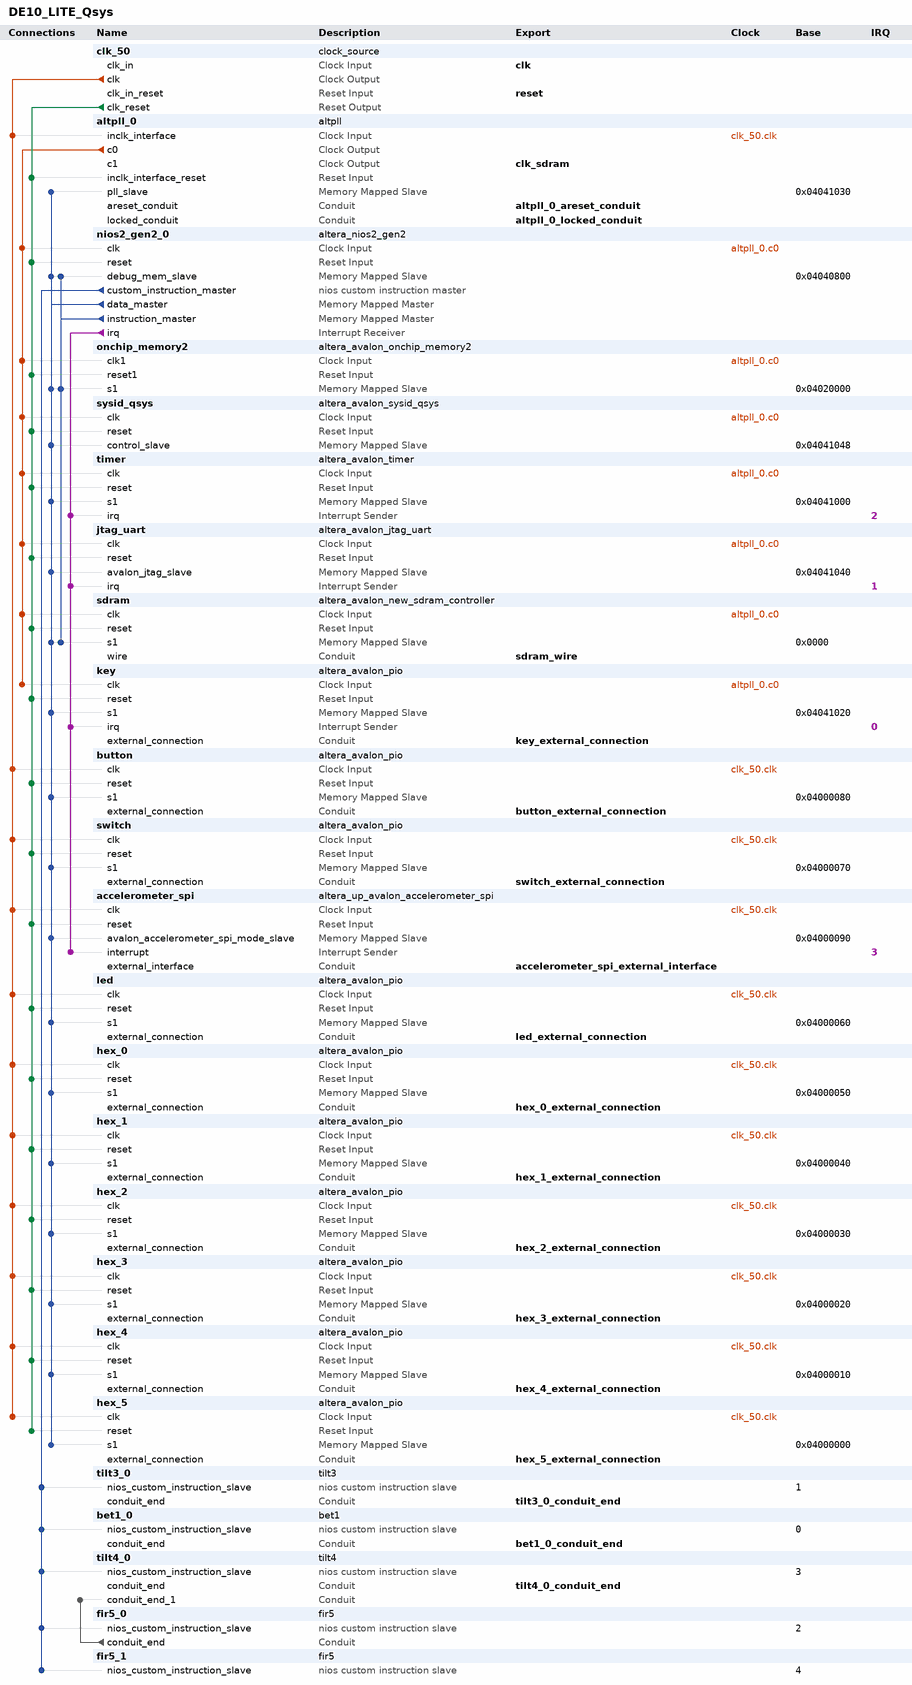
[diagram p0: system contents]
# Platform Designer (Qsys) system DE10_LITE_Qsys, MAX 10 10M50DAF484C7G
# Parameters at their usual value, and those the tool derives, are not listed.
package require -exact qsys 20.1
create_system DE10_LITE_Qsys
set_project_property DEVICE_FAMILY {MAX 10}
set_project_property DEVICE 10M50DAF484C7G

add_instance clk_50 clock_source 20.1
set_instance_parameter_value clk_50 clockFrequency 50000000

add_instance altpll_0 altpll 20.1
set_instance_parameter_value altpll_0 CLK0_DIVIDE_BY 1
set_instance_parameter_value altpll_0 CLK0_MULTIPLY_BY 2
set_instance_parameter_value altpll_0 CLK1_DIVIDE_BY 1
set_instance_parameter_value altpll_0 CLK1_DUTY_CYCLE 50
set_instance_parameter_value altpll_0 CLK1_MULTIPLY_BY 2
set_instance_parameter_value altpll_0 CLK1_PHASE_SHIFT -3000
set_instance_parameter_value altpll_0 INCLK0_INPUT_FREQUENCY 20000
set_instance_parameter_value altpll_0 PORT_ARESET PORT_USED
set_instance_parameter_value altpll_0 PORT_LOCKED PORT_USED
set_instance_parameter_value altpll_0 PORT_clk1 PORT_USED
set_instance_parameter_value altpll_0 PORT_clk2 PORT_UNUSED
set_instance_parameter_value altpll_0 PORT_clk3 PORT_UNUSED

add_instance nios2_gen2_0 altera_nios2_gen2 20.1
set_instance_parameter_value nios2_gen2_0 dcache_size 2048
set_instance_parameter_value nios2_gen2_0 exceptionSlave sdram.s1
set_instance_parameter_value nios2_gen2_0 icache_size 4096
set_instance_parameter_value nios2_gen2_0 impl Fast
set_instance_parameter_value nios2_gen2_0 resetSlave sdram.s1

add_instance onchip_memory2 altera_avalon_onchip_memory2 20.1
set_instance_parameter_value onchip_memory2 dataWidth 32
set_instance_parameter_value onchip_memory2 dualPort false
set_instance_parameter_value onchip_memory2 initMemContent false
set_instance_parameter_value onchip_memory2 initializationFileName onchip_mem.hex
set_instance_parameter_value onchip_memory2 memorySize 100000

add_instance sysid_qsys altera_avalon_sysid_qsys 20.1
set_instance_parameter_value sysid_qsys id 0

add_instance timer altera_avalon_timer 20.1
set_instance_parameter_value timer period 1
set_instance_parameter_value timer periodUnits MSEC

add_instance jtag_uart altera_avalon_jtag_uart 20.1
set_instance_parameter_value jtag_uart simInteractiveOptions NO_INTERACTIVE_WINDOWS

add_instance sdram altera_avalon_new_sdram_controller 20.1
set_instance_parameter_value sdram TAC 5.4
set_instance_parameter_value sdram TRCD 15.0
set_instance_parameter_value sdram TRP 15.0
set_instance_parameter_value sdram casLatency 3
set_instance_parameter_value sdram columnWidth 10
set_instance_parameter_value sdram dataWidth 16
set_instance_parameter_value sdram generateSimulationModel true
set_instance_parameter_value sdram model single_Micron_MT48LC4M32B2_7_chip
set_instance_parameter_value sdram numberOfBanks 4
set_instance_parameter_value sdram numberOfChipSelects 1
set_instance_parameter_value sdram powerUpDelay 100.0
set_instance_parameter_value sdram refreshPeriod 7.8125
set_instance_parameter_value sdram rowWidth 13

add_instance key altera_avalon_pio 20.1
set_instance_parameter_value key captureEdge true
set_instance_parameter_value key direction Input
set_instance_parameter_value key edgeType FALLING
set_instance_parameter_value key generateIRQ true
set_instance_parameter_value key irqType EDGE
set_instance_parameter_value key width 4

add_instance button altera_avalon_pio 20.1
set_instance_parameter_value button direction Input
set_instance_parameter_value button width 4

add_instance switch altera_avalon_pio 20.1
set_instance_parameter_value switch direction Input
set_instance_parameter_value switch width 10

add_instance accelerometer_spi altera_up_avalon_accelerometer_spi 18.0

add_instance led altera_avalon_pio 20.1
set_instance_parameter_value led direction Output
set_instance_parameter_value led width 10

add_instance hex_0 altera_avalon_pio 20.1
set_instance_parameter_value hex_0 direction Output
set_instance_parameter_value hex_0 width 7

add_instance hex_1 altera_avalon_pio 20.1
set_instance_parameter_value hex_1 direction Output
set_instance_parameter_value hex_1 width 7

add_instance hex_2 altera_avalon_pio 20.1
set_instance_parameter_value hex_2 direction Output
set_instance_parameter_value hex_2 width 7

add_instance hex_3 altera_avalon_pio 20.1
set_instance_parameter_value hex_3 direction Output
set_instance_parameter_value hex_3 width 7

add_instance hex_4 altera_avalon_pio 20.1
set_instance_parameter_value hex_4 direction Output
set_instance_parameter_value hex_4 width 7

add_instance hex_5 altera_avalon_pio 20.1
set_instance_parameter_value hex_5 direction Output
set_instance_parameter_value hex_5 width 7

add_instance tilt3_0 tilt3 1.0
set_instance_parameter_value tilt3_0 LATENCY 0

add_instance bet1_0 bet1 1.0
set_instance_parameter_value bet1_0 LATENCY 0

add_instance tilt4_0 tilt4 1.0
set_instance_parameter_value tilt4_0 LATENCY 0

add_instance fir5_0 fir5 1.0
set_instance_parameter_value fir5_0 LATENCY 0

add_instance fir5_1 fir5 1.0
set_instance_parameter_value fir5_1 LATENCY 0

# connections
add_connection altpll_0.c0 jtag_uart.clk clock
add_connection altpll_0.c0 key.clk clock
add_connection altpll_0.c0 nios2_gen2_0.clk clock
add_connection altpll_0.c0 onchip_memory2.clk1 clock
add_connection altpll_0.c0 sdram.clk clock
add_connection altpll_0.c0 sysid_qsys.clk clock
add_connection altpll_0.c0 timer.clk clock
add_connection clk_50.clk accelerometer_spi.clk clock
add_connection clk_50.clk altpll_0.inclk_interface clock
add_connection clk_50.clk button.clk clock
add_connection clk_50.clk hex_0.clk clock
add_connection clk_50.clk hex_1.clk clock
add_connection clk_50.clk hex_2.clk clock
add_connection clk_50.clk hex_3.clk clock
add_connection clk_50.clk hex_4.clk clock
add_connection clk_50.clk hex_5.clk clock
add_connection clk_50.clk led.clk clock
add_connection clk_50.clk switch.clk clock
add_connection clk_50.clk_reset accelerometer_spi.reset reset
add_connection clk_50.clk_reset altpll_0.inclk_interface_reset reset
add_connection clk_50.clk_reset button.reset reset
add_connection clk_50.clk_reset hex_0.reset reset
add_connection clk_50.clk_reset hex_1.reset reset
add_connection clk_50.clk_reset hex_2.reset reset
add_connection clk_50.clk_reset hex_3.reset reset
add_connection clk_50.clk_reset hex_4.reset reset
add_connection clk_50.clk_reset hex_5.reset reset
add_connection clk_50.clk_reset jtag_uart.reset reset
add_connection clk_50.clk_reset key.reset reset
add_connection clk_50.clk_reset led.reset reset
add_connection clk_50.clk_reset nios2_gen2_0.reset reset
add_connection clk_50.clk_reset onchip_memory2.reset1 reset
add_connection clk_50.clk_reset sdram.reset reset
add_connection clk_50.clk_reset switch.reset reset
add_connection clk_50.clk_reset sysid_qsys.reset reset
add_connection clk_50.clk_reset timer.reset reset
add_connection nios2_gen2_0.data_master accelerometer_spi.avalon_accelerometer_spi_mode_slave avalon
set_connection_parameter_value nios2_gen2_0.data_master/accelerometer_spi.avalon_accelerometer_spi_mode_slave baseAddress 0x04000090
add_connection nios2_gen2_0.data_master altpll_0.pll_slave avalon
set_connection_parameter_value nios2_gen2_0.data_master/altpll_0.pll_slave baseAddress 0x04041030
add_connection nios2_gen2_0.data_master button.s1 avalon
set_connection_parameter_value nios2_gen2_0.data_master/button.s1 baseAddress 0x04000080
add_connection nios2_gen2_0.data_master hex_0.s1 avalon
set_connection_parameter_value nios2_gen2_0.data_master/hex_0.s1 baseAddress 0x04000050
add_connection nios2_gen2_0.data_master hex_1.s1 avalon
set_connection_parameter_value nios2_gen2_0.data_master/hex_1.s1 baseAddress 0x04000040
add_connection nios2_gen2_0.data_master hex_2.s1 avalon
set_connection_parameter_value nios2_gen2_0.data_master/hex_2.s1 baseAddress 0x04000030
add_connection nios2_gen2_0.data_master hex_3.s1 avalon
set_connection_parameter_value nios2_gen2_0.data_master/hex_3.s1 baseAddress 0x04000020
add_connection nios2_gen2_0.data_master hex_4.s1 avalon
set_connection_parameter_value nios2_gen2_0.data_master/hex_4.s1 baseAddress 0x04000010
add_connection nios2_gen2_0.data_master hex_5.s1 avalon
set_connection_parameter_value nios2_gen2_0.data_master/hex_5.s1 baseAddress 0x04000000
add_connection nios2_gen2_0.data_master jtag_uart.avalon_jtag_slave avalon
set_connection_parameter_value nios2_gen2_0.data_master/jtag_uart.avalon_jtag_slave baseAddress 0x04041040
add_connection nios2_gen2_0.data_master key.s1 avalon
set_connection_parameter_value nios2_gen2_0.data_master/key.s1 baseAddress 0x04041020
add_connection nios2_gen2_0.data_master led.s1 avalon
set_connection_parameter_value nios2_gen2_0.data_master/led.s1 baseAddress 0x04000060
add_connection nios2_gen2_0.data_master nios2_gen2_0.debug_mem_slave avalon
set_connection_parameter_value nios2_gen2_0.data_master/nios2_gen2_0.debug_mem_slave baseAddress 0x04040800
add_connection nios2_gen2_0.data_master onchip_memory2.s1 avalon
set_connection_parameter_value nios2_gen2_0.data_master/onchip_memory2.s1 baseAddress 0x04020000
add_connection nios2_gen2_0.data_master sdram.s1 avalon
set_connection_parameter_value nios2_gen2_0.data_master/sdram.s1 baseAddress 0x0000
add_connection nios2_gen2_0.data_master switch.s1 avalon
set_connection_parameter_value nios2_gen2_0.data_master/switch.s1 baseAddress 0x04000070
add_connection nios2_gen2_0.data_master sysid_qsys.control_slave avalon
set_connection_parameter_value nios2_gen2_0.data_master/sysid_qsys.control_slave baseAddress 0x04041048
add_connection nios2_gen2_0.data_master timer.s1 avalon
set_connection_parameter_value nios2_gen2_0.data_master/timer.s1 baseAddress 0x04041000
add_connection nios2_gen2_0.instruction_master nios2_gen2_0.debug_mem_slave avalon
set_connection_parameter_value nios2_gen2_0.instruction_master/nios2_gen2_0.debug_mem_slave baseAddress 0x04040800
add_connection nios2_gen2_0.instruction_master onchip_memory2.s1 avalon
set_connection_parameter_value nios2_gen2_0.instruction_master/onchip_memory2.s1 baseAddress 0x04020000
add_connection nios2_gen2_0.instruction_master sdram.s1 avalon
set_connection_parameter_value nios2_gen2_0.instruction_master/sdram.s1 baseAddress 0x0000
add_connection fir5_0.conduit_end tilt4_0.conduit_end_1 conduit
add_connection nios2_gen2_0.irq accelerometer_spi.interrupt interrupt
set_connection_parameter_value nios2_gen2_0.irq/accelerometer_spi.interrupt irqNumber 3
add_connection nios2_gen2_0.irq jtag_uart.irq interrupt
set_connection_parameter_value nios2_gen2_0.irq/jtag_uart.irq irqNumber 1
add_connection nios2_gen2_0.irq key.irq interrupt
set_connection_parameter_value nios2_gen2_0.irq/key.irq irqNumber 0
add_connection nios2_gen2_0.irq timer.irq interrupt
set_connection_parameter_value nios2_gen2_0.irq/timer.irq irqNumber 2
add_connection nios2_gen2_0.custom_instruction_master bet1_0.nios_custom_instruction_slave nios_custom_instruction
set_connection_parameter_value nios2_gen2_0.custom_instruction_master/bet1_0.nios_custom_instruction_slave CIName bet1_0
set_connection_parameter_value nios2_gen2_0.custom_instruction_master/bet1_0.nios_custom_instruction_slave baseAddress 0
add_connection nios2_gen2_0.custom_instruction_master fir5_0.nios_custom_instruction_slave nios_custom_instruction
set_connection_parameter_value nios2_gen2_0.custom_instruction_master/fir5_0.nios_custom_instruction_slave CIName fir5_0
set_connection_parameter_value nios2_gen2_0.custom_instruction_master/fir5_0.nios_custom_instruction_slave baseAddress 2
add_connection nios2_gen2_0.custom_instruction_master fir5_1.nios_custom_instruction_slave nios_custom_instruction
set_connection_parameter_value nios2_gen2_0.custom_instruction_master/fir5_1.nios_custom_instruction_slave CIName fir5_1
set_connection_parameter_value nios2_gen2_0.custom_instruction_master/fir5_1.nios_custom_instruction_slave baseAddress 4
add_connection nios2_gen2_0.custom_instruction_master tilt3_0.nios_custom_instruction_slave nios_custom_instruction
set_connection_parameter_value nios2_gen2_0.custom_instruction_master/tilt3_0.nios_custom_instruction_slave CIName tilt3_0
set_connection_parameter_value nios2_gen2_0.custom_instruction_master/tilt3_0.nios_custom_instruction_slave baseAddress 1
add_connection nios2_gen2_0.custom_instruction_master tilt4_0.nios_custom_instruction_slave nios_custom_instruction
set_connection_parameter_value nios2_gen2_0.custom_instruction_master/tilt4_0.nios_custom_instruction_slave CIName tilt4_0
set_connection_parameter_value nios2_gen2_0.custom_instruction_master/tilt4_0.nios_custom_instruction_slave baseAddress 3

# exported interfaces
add_interface accelerometer_spi_external_interface conduit end
set_interface_property accelerometer_spi_external_interface EXPORT_OF accelerometer_spi.external_interface
add_interface altpll_0_areset_conduit conduit end
set_interface_property altpll_0_areset_conduit EXPORT_OF altpll_0.areset_conduit
add_interface altpll_0_locked_conduit conduit end
set_interface_property altpll_0_locked_conduit EXPORT_OF altpll_0.locked_conduit
add_interface bet1_0_conduit_end conduit end
set_interface_property bet1_0_conduit_end EXPORT_OF bet1_0.conduit_end
add_interface button_external_connection conduit end
set_interface_property button_external_connection EXPORT_OF button.external_connection
add_interface clk clock sink
set_interface_property clk EXPORT_OF clk_50.clk_in
add_interface clk_sdram clock source
set_interface_property clk_sdram EXPORT_OF altpll_0.c1
add_interface hex_0_external_connection conduit end
set_interface_property hex_0_external_connection EXPORT_OF hex_0.external_connection
add_interface hex_1_external_connection conduit end
set_interface_property hex_1_external_connection EXPORT_OF hex_1.external_connection
add_interface hex_2_external_connection conduit end
set_interface_property hex_2_external_connection EXPORT_OF hex_2.external_connection
add_interface hex_3_external_connection conduit end
set_interface_property hex_3_external_connection EXPORT_OF hex_3.external_connection
add_interface hex_4_external_connection conduit end
set_interface_property hex_4_external_connection EXPORT_OF hex_4.external_connection
add_interface hex_5_external_connection conduit end
set_interface_property hex_5_external_connection EXPORT_OF hex_5.external_connection
add_interface key_external_connection conduit end
set_interface_property key_external_connection EXPORT_OF key.external_connection
add_interface led_external_connection conduit end
set_interface_property led_external_connection EXPORT_OF led.external_connection
add_interface reset reset sink
set_interface_property reset EXPORT_OF clk_50.clk_in_reset
add_interface sdram_wire conduit end
set_interface_property sdram_wire EXPORT_OF sdram.wire
add_interface switch_external_connection conduit end
set_interface_property switch_external_connection EXPORT_OF switch.external_connection
add_interface tilt3_0_conduit_end conduit end
set_interface_property tilt3_0_conduit_end EXPORT_OF tilt3_0.conduit_end
add_interface tilt4_0_conduit_end conduit end
set_interface_property tilt4_0_conduit_end EXPORT_OF tilt4_0.conduit_end

set_interconnect_requirement {$system} qsys_mm.clockCrossingAdapter HANDSHAKE
set_interconnect_requirement {$system} qsys_mm.maxAdditionalLatency 1

save_system DE10_LITE_Qsys.qsys
